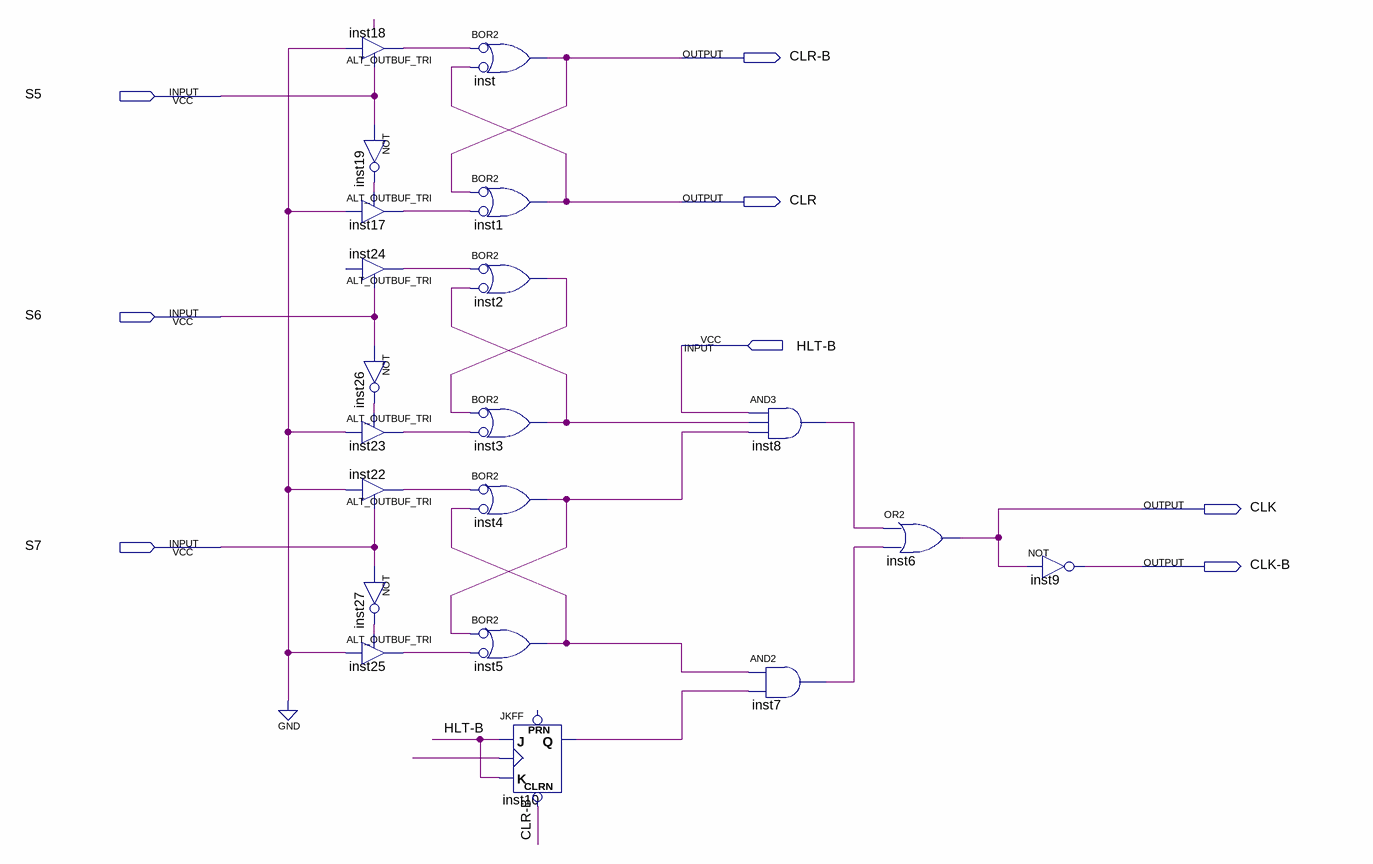
[diagram p0: schematic sheet]
// Quartus schematic Gerador_de_Clock_Reset.bdf as structural Verilog: 20 symbols, 8 pins
module Gerador_de_Clock_Reset (
  input  S5,
  input  S6,
  input  \HLT-B ,
  input  S7,
  output \CLR-B ,
  output CLR,
  output CLK,
  output \CLK-B 
);

  wire inst2_out, inst3_out, inst4_out, inst5_out, inst7_out, inst8_out, inst10_q, inst17_o, inst18_o,
       inst19_out, inst22_o, inst23_o, inst24_o, inst25_o, inst26_out, inst27_out, undriven;

  ALT_OUTBUF_TRI inst18 (.i(1'b0), .oe(S5), .o(inst18_o));
  not inst19 (inst19_out, S5);
  ALT_OUTBUF_TRI inst17 (.i(1'b0), .oe(inst19_out), .o(inst17_o));
  ALT_OUTBUF_TRI inst24 (.oe(S6), .o(inst24_o));  // open: i
  not inst26 (inst26_out, S6);
  ALT_OUTBUF_TRI inst23 (.i(1'b0), .oe(inst26_out), .o(inst23_o));
  ALT_OUTBUF_TRI inst22 (.i(1'b0), .oe(S7), .o(inst22_o));
  not inst27 (inst27_out, S7);
  ALT_OUTBUF_TRI inst25 (.i(1'b0), .oe(inst27_out), .o(inst25_o));
  or inst (\CLR-B , ~inst18_o, ~CLR);  // BOR2
  or inst1 (CLR, ~\CLR-B , ~inst17_o);  // BOR2
  or inst2 (inst2_out, ~inst24_o, ~inst3_out);  // BOR2
  or inst3 (inst3_out, ~inst2_out, ~inst23_o);  // BOR2
  or inst4 (inst4_out, ~inst22_o, ~inst5_out);  // BOR2
  or inst5 (inst5_out, ~inst4_out, ~inst25_o);  // BOR2
  JKFF inst10 (.CLRN(\CLR-B ), .K(\HLT-B ), .J(\HLT-B ), .CLK(undriven), .Q(inst10_q));  // open: PRN
  and inst8 (inst8_out, \HLT-B , inst3_out, inst4_out);
  and inst7 (inst7_out, inst5_out, inst10_q);
  or inst6 (CLK, inst8_out, inst7_out);
  not inst9 (\CLK-B , CLK);
endmodule
